# EAGLE schematic Sound_Module (EAGLE 7.1.0)
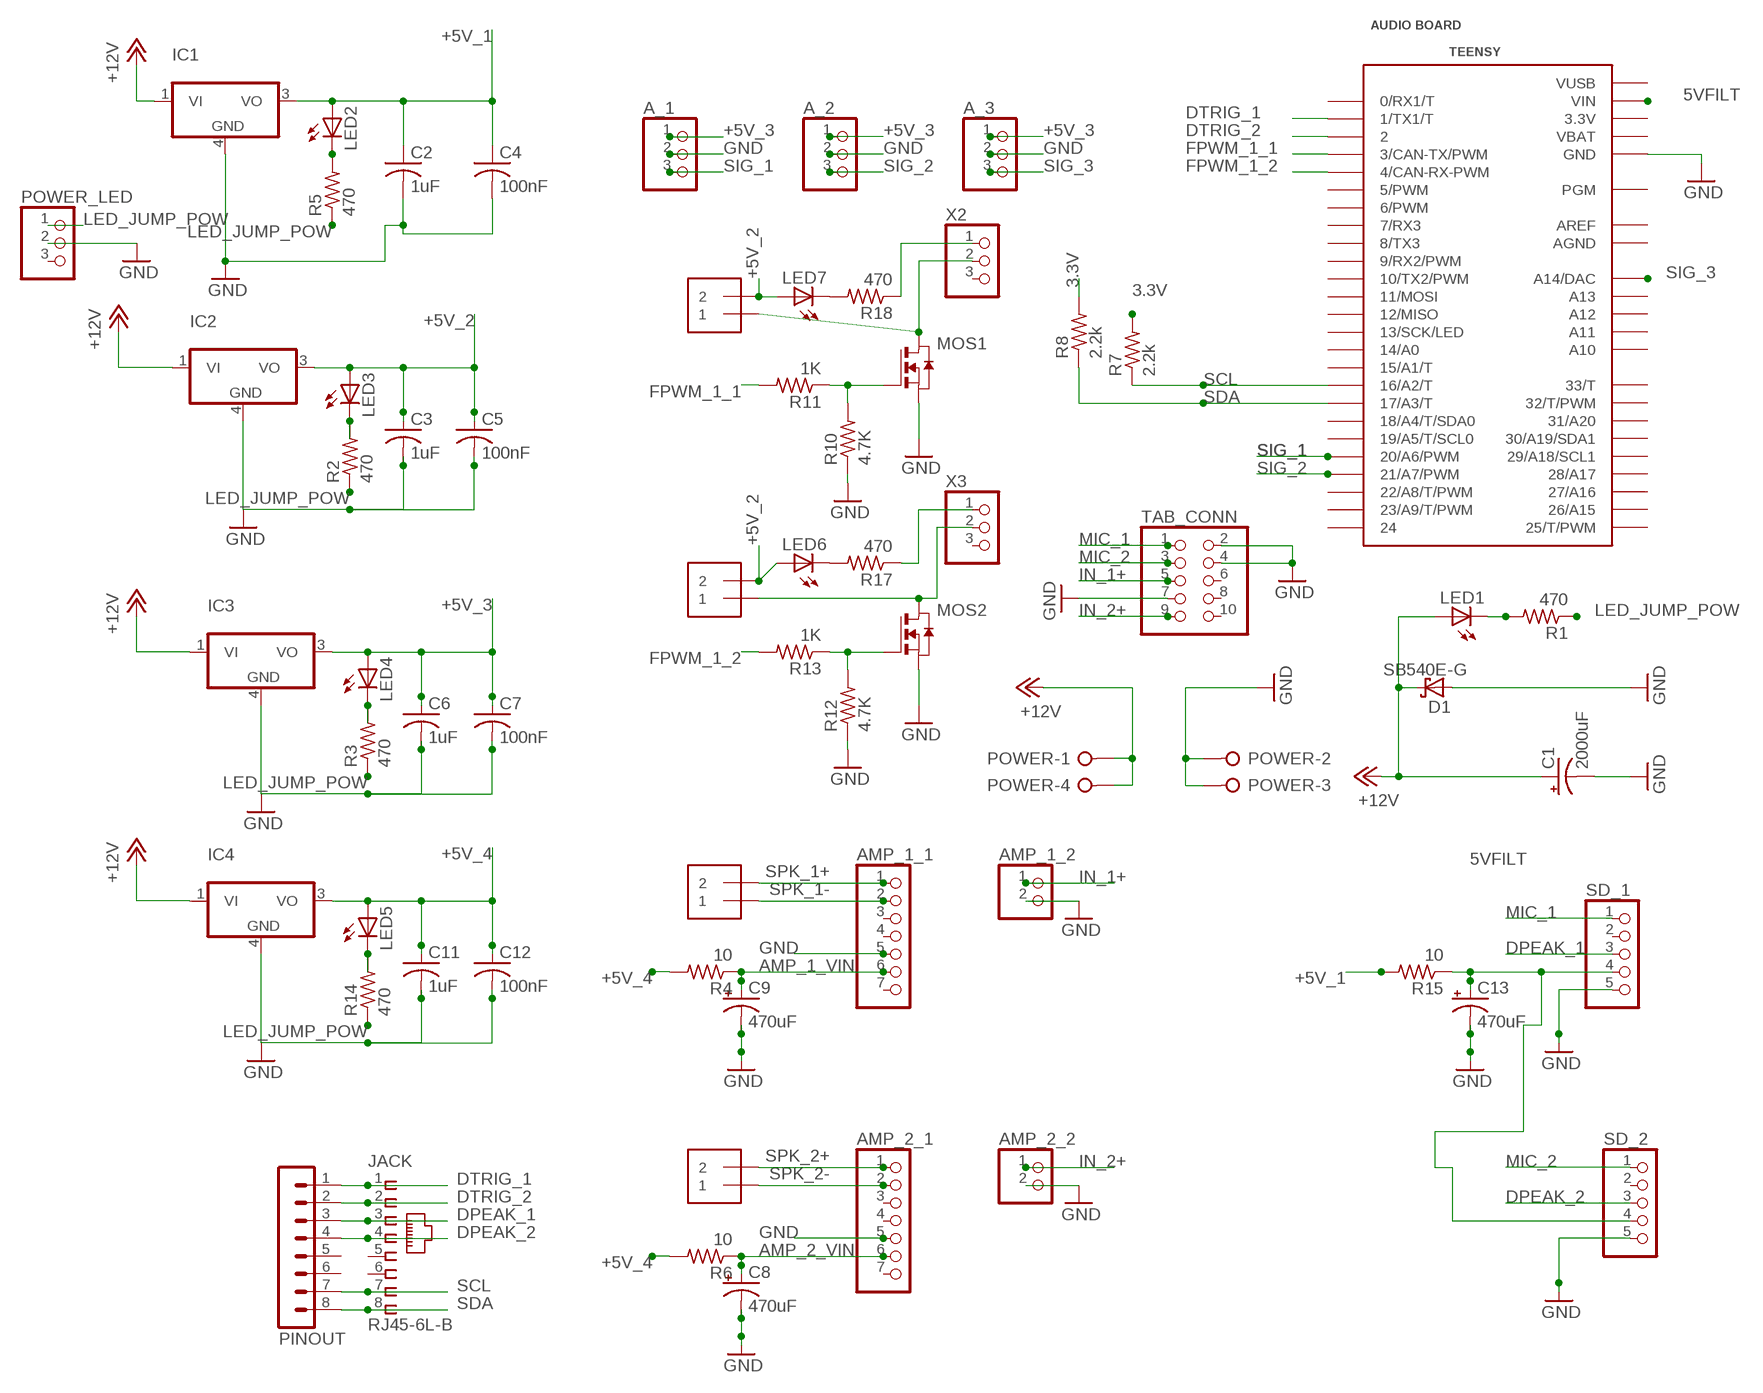
[diagram p0: schematic, sheet 1]

## Parts
A_1  PINHD-1X3  [1X03]
A_2  PINHD-1X3  [1X03]
A_3  PINHD-1X3  [1X03]
AMP_1_1  PINHD-1X7  [1X07]
AMP_1_2  PINHD-1X2  [1X02]
AMP_2_1  PINHD-1X7  [1X07]
AMP_2_2  PINHD-1X2  [1X02]
C1  2000uF  CPOL-USE5-10.5  [E5-10,5]
C2  1uF  C-USC0603  [C0603]
C3  1uF  C-USC0603  [C0603]
C4  100nF  C-USC0603  [C0603]
C5  100nF  C-USC0603  [C0603]
C6  1uF  C-USC0603  [C0603]
C7  100nF  C-USC0603  [C0603]
C8  470uF  CPOL-USE5-10.5  [E5-10,5]
C9  470uF  CPOL-USE5-10.5  [E5-10,5]
C11  1uF  C-USC0603  [C0603]
C12  100nF  C-USC0603  [C0603]
C13  470uF  CPOL-USE5-10.5  [E5-10,5]
D1  SB540E-G  [DO201T15]
IC1  MC7805BDTRKG  [DPACK_3]
IC2  MC7805BDTRKG  [DPACK_3]
IC3  MC7805BDTRKG  [DPACK_3]
IC4  MC7805BDTRKG  [DPACK_3]
JACK  RJ45-6L-B  [RJ45-NO-SHIELD]
LED1  LEDSML1206  [SML1206]
LED2  LEDSML1206  [SML1206]
LED3  LEDSML1206  [SML1206]
LED4  LEDSML1206  [SML1206]
LED5  LEDSML1206  [SML1206]
LED6  LEDSML1206  [SML1206]
LED7  LEDSML1206  [SML1206]
MOS1  NTD5867NLT4G  [DPACK]
MOS2  NTD5867NLT4G  [DPACK]
PINOUT  MA08-1  [MA08-1]
POWER  W237-04P  [W237-4P]
POWER_LED  PINHD-1X3  [1X03]
PWM1  1X2-3.5MM  [1X2-3.5MM]
PWM2  1X2-3.5MM  [1X2-3.5MM]
R1  470  R-US_R0603  [R0603]
R2  470  R-US_R0603  [R0603]
R3  470  R-US_R0603  [R0603]
R4  10  R-US_R0603  [R0603]
R5  470  R-US_R0603  [R0603]
R6  10  R-US_R0603  [R0603]
R7  2.2k  R-US_R0603  [R0603]
R8  2.2k  R-US_R0603  [R0603]
R10  4.7K  R-US_R0603  [R0603]
R11  1K  R-US_R0603  [R0603]
R12  4.7K  R-US_R0603  [R0603]
R13  1K  R-US_R0603  [R0603]
R14  470  R-US_R0603  [R0603]
R15  10  R-US_R0603  [R0603]
R17  470  R-US_R0603  [R0603]
R18  470  R-US_R0603  [R0603]
SD_1  PINHD-1X5  [1X05]
SD_2  PINHD-1X5  [1X05]
SPK-1  1X2-3.5MM  [1X2-3.5MM]
SPK-2  1X2-3.5MM  [1X2-3.5MM]
TAB_CONN  PINHD-2X5  [2X05]
TEENSY  AUDIO BOARD  TEENSY_3.1_ALL_PINS_AND_PADS  [TEENSY_3.1_ALLPINS]
X2  PINHD-1X3  [1X03]
X3  PINHD-1X3  [1X03]

## Nets
3.3V: R7.2 R8.2
5VFILT: C13.+ R15.1 SD_1.4 SD_2.4 TEENSY.VIN
+5V_1: C2.1 C4.1 IC1.3(VO) LED2.A R15.2
+5V_2: C3.1 C5.1 IC2.3(VO) LED3.A LED6.A LED7.A PWM1.2 PWM2.2
+5V_3: A_1.1 A_2.1 A_3.1 C6.1 C7.1 IC3.3(VO) LED4.A
+5V_4: C11.1 C12.1 IC4.3(VO) LED5.A R4.2 R6.2
+12V: C1.+ D1.C IC1.1(VI) IC2.1(VI) IC3.1(VI) IC4.1(VI) LED1.A POWER.1 POWER.4
AMP_1_VIN: AMP_1_1.6 C9.+ R4.1
AMP_2_VIN: AMP_2_1.6 C8.+ R6.1
DPEAK_1: JACK.3 PINOUT.3 SD_1.3
DPEAK_2: JACK.4 PINOUT.4 SD_2.3
DTRIG_1: JACK.1 PINOUT.1 TEENSY.1(1/TX1/T)
DTRIG_2: JACK.2 PINOUT.2 TEENSY.2
FPWM_1_1: R11.2 TEENSY.3(3/CAN-TX/PWM)
FPWM_1_2: R13.2 TEENSY.4(4/CAN-RX-PWM)
GND: A_1.2 A_2.2 A_3.2 AMP_1_1.5 AMP_1_2.2 AMP_2_1.5 AMP_2_2.2 C1.- C2.2 C3.2 C4.2 C5.2 C6.2 C7.2 C8.- C9.- C11.2 C12.2 C13.- D1.A IC1.4(GND) IC2.4(GND) IC3.4(GND) IC4.4(GND) MOS1.3(S) MOS2.3(S) POWER.2 POWER.3 POWER_LED.2 R10.1 R12.1 SD_1.5 SD_2.5 TAB_CONN.2 TAB_CONN.4 TAB_CONN.7 TEENSY.GND TEENSY.GND1(GND) TEENSY.GND2(GND)
IN_1+: AMP_1_2.1 TAB_CONN.5
IN_2+: AMP_2_2.1 TAB_CONN.9
LED_JUMP_POW: POWER_LED.1 R1.1 R2.1 R3.1 R5.1 R14.1
MIC_1: SD_1.1 TAB_CONN.1
MIC_2: SD_2.1 TAB_CONN.3
N$1: MOS2.1(G) R12.2 R13.1
N$2: LED3.C R2.2
N$3: LED4.C R3.2
N$4: MOS1.1(G) R10.2 R11.1
N$5: MOS1.2(D) PWM1.1 X2.2
N$6: LED6.C R17.2
N$7: MOS2.2(D) PWM2.1 X3.2
N$8: LED5.C R14.2
N$9: LED7.C R18.2
N$10: LED1.C R1.2
N$12: R18.1 X2.1
N$13: R17.1 X3.1
N$19: LED2.C R5.2
SCL: JACK.7 PINOUT.7 R7.1 TEENSY.16/A2(16/A2/T)
SDA: JACK.8 PINOUT.8 R8.1 TEENSY.17/A3(17/A3/T)
SIG_1: A_1.3 TEENSY.20/A6(20/A6/PWM)
SIG_2: A_2.3 TEENSY.21/A7(21/A7/PWM)
SIG_3: A_3.3 TEENSY.A14(A14/DAC)
SPK_1+: AMP_1_1.1 SPK-1.2
SPK_1-: AMP_1_1.2 SPK-1.1
SPK_2+: AMP_2_1.1 SPK-2.2
SPK_2-: AMP_2_1.2 SPK-2.1
Unconnected: AMP_1_1.3 AMP_1_1.4 AMP_1_1.7 AMP_2_1.3 AMP_2_1.4 AMP_2_1.7 JACK.5 JACK.6 PINOUT.5 PINOUT.6 POWER_LED.3 SD_1.2 SD_2.2 TAB_CONN.6 TAB_CONN.8 TAB_CONN.10 TEENSY.0(0/RX1/T) TEENSY.5(5/PWM) TEENSY.6(6/PWM) TEENSY.7(7/RX3) TEENSY.8(8/TX3) TEENSY.9(9/RX2/PWM) TEENSY.10(10/TX2/PWM) TEENSY.11(11/MOSI) TEENSY.12(12/MISO) TEENSY.13(13/SCK/LED) TEENSY.14/A0 TEENSY.15/A1(15/A1/T) TEENSY.18/A4(18/A4/T/SDA0) TEENSY.19/A5(19/A5/T/SCL0) TEENSY.22/A8(22/A8/T/PWM) TEENSY.23/A9(23/A9/T/PWM) TEENSY.24 TEENSY.25(25/T/PWM) TEENSY.26(26/A15) TEENSY.27(27/A16) TEENSY.28(28/A17) TEENSY.29(29/A18/SCL1) TEENSY.30(30/A19/SDA1) TEENSY.31(31/A20) TEENSY.32(32/T/PWM) TEENSY.33(33/T) TEENSY.A10 TEENSY.A11 TEENSY.A12 TEENSY.A13 TEENSY.PGM X2.3 X3.3

## Power pins joined to a net without a drawn wire
3.3V: TEENSY.3.3V TEENSY.3.3V1(3.3V) TEENSY.3.3V2(3.3V)
AGND: TEENSY.AGND
AREF: TEENSY.AREF
VBAT: TEENSY.VBAT
VUSB: TEENSY.VUSB

## Library data of the parts
A_1-A_3 POWER_LED X2 X3 = CBLA_Test_bed_Library:PINHD-1X3: PIN HEADER
AMP_1_1 AMP_2_1 = pinhead:PINHD-1X7: PIN HEADER
AMP_1_2 AMP_2_2 = pinhead:PINHD-1X2: PIN HEADER
C1 C8 C9 C13 = rcl:CPOL-US: POLARIZED CAPACITOR, American symbol
C2-C7 C11 C12 = rcl:C-US: CAPACITOR, American symbol
D1 = CBLA_Test_bed_Library:SB540E-G: SCHOTTKY BARRIER RECTIFIER 3.0 AMPERES 20, 30, 40 VOLT Source: MBRS340T3-D.pdf
IC1-IC4 = CBLA_Test_bed_Library:MC78: 1A Positive Voltage Regulators Source: Data sheet <http://www.onsemi.com/pub_link/Collateral/MC7800-D.PDF>
JACK = CBLA_Test_bed_Library:RJ45: CORCOM Modular RJ Jacks No Shield Source: www.tycoelectronics.com .. ENG_DS_1654001_1099_RJ_L_0507.pdf; MPN: RJ45-6L-B; OC_FARNELL: unknown; OC_NEWARK: 16R6090
LED1-LED7 = led:LED: LED OSRAM: - CHIPLED LG R971, LG N971, LY N971, LG Q971, LY Q971, LO R971, LY R971 LH N974, LH R974 LS Q976, LO Q976, LY Q976 LO Q996 - Hyper CHIPLED LW Q18S LB Q993, LB Q99A, LB R99A - SideLED LS A670, LO A670, LY A670, LG A670, LP A670 LB A673, LV A673, LT A673, LW A673 LH A674 LY A675 LS A676, LA A676, LO A676, LY A676, LW A676 LS A679, LY A679, LG A679 - Hyper Micro SIDELED® LS Y876, LA Y876, LO Y876, LY Y876 LT Y87S - SmartLED LW L88C, LW L88S LB L89C, LB L89S, LG L890 LS L89K, LO L89K, LY L89K LS L896, LA L896, LO L896, LY L896 - TOPLED LS T670, LO T670, LY T670, LG T670, LP T670 LSG T670, LSP T670, LSY T670, LOP T670, LYG T670 LG T671, LOG T671, LSG T671 LB T673, LV T673, LT T673, LW T673 LH T674 LS T676, LA T676, LO T676, LY T676, LB T676, LH T676, LSB T676, LW T676 LB T67C, LV T67C, LT T67C, LS T67K, LO T67K, LY T67K, LW E67C LS E67B, LA E67B, LO E67B, LY E67B, LB E67C, LV E67C, LT E67C LW T67C LS T679, LY T679, LG T679 LS T770, LO T770, LY T770, LG T770, LP T770 LB T773, LV T773, LT T773, LW T773 LH T774 LS E675, LA E675, LY E675, LS T675 LS T776, LA T776, LO T776, LY T776, LB T776 LHGB T686 LT T68C, LB T68C - Hyper Mini TOPLED® LB M676 - Mini TOPLED Santana® LG M470 LS M47K, LO M47K, LY M47K Source: http://www.osram.convergy.de LUXEON: - LUMILED® LXK2-PW12-R00, LXK2-PW12-S00, LXK2-PW14-U00, LXK2-PW14-V00 LXK2-PM12-R00, LXK2-PM12-S00, LXK2-PM14-U00 LXK2-PE12-Q00, LXK2-PE12-R00, LXK2-PE12-S00, LXK2-PE14-T00, LXK2-PE14-U00 LXK2-PB12-K00, LXK2-PB12-L00, LXK2-PB12-M00, LXK2-PB14-N00, LXK2-PB14-P00, LXK2-PB14-Q00 LXK2-PR12-L00, LXK2-PR12-M00, LXK2-PR14-Q00, LXK2-PR14-R00 LXK2-PD12-Q00, LXK2-PD12-R00, LXK2-PD12-S00 LXK2-PH12-R00, LXK2-PH12-S00 LXK2-PL12-P00, LXK2-PL12-Q00, LXK2-PL12-R00 Source: www.luxeon.com KINGBRIGHT: KA-3528ASYC Source: www.kingbright.com
MOS1 MOS2 = CBLA_Test_bed_Library:NTD5867NL: MOS FET
PINOUT = con-lstb:MA08-1: PIN HEADER; OC_FARNELL: unknown; OC_NEWARK: unknown
POWER = con-wago-508:W237-04P: WAGO SREW CLAMP; OC_FARNELL: unknown; OC_NEWARK: unknown
PWM1 PWM2 SPK-1 SPK-2 = ActuatorBoard_v1.2:1X2: 3.5mm Terminal block http://www.ladyada.net/library/pcb/eaglelibrary.html
R1-R8 R10-R15 R17 R18 = CBLA_Test_bed_Library:R-US_: RESISTOR, American symbol
SD_1 SD_2 = pinhead:PINHD-1X5: PIN HEADER
TAB_CONN = pinhead:PINHD-2X5: PIN HEADER
TEENSY = Teensy_3_Series_Board_v1.0:TEENSY_3.1_ALL_PINS_AND_PADS: Footprint for Teensy 3.1 board using all pads and all through-holes. Pads need a 2x7 0.1" SMD header.